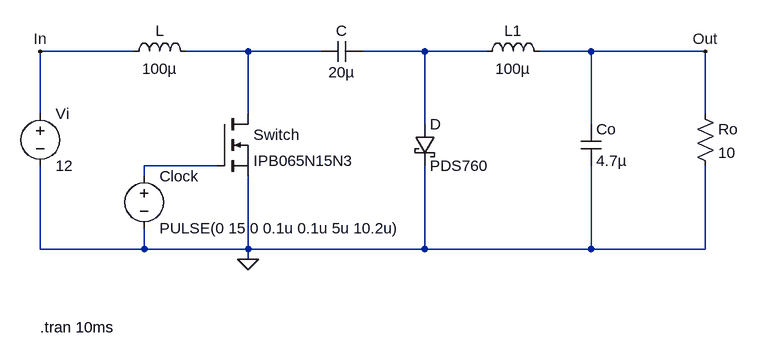
[diagram p0: schematic Cuk Converter.asc]
Cuk Converter.asc, the LTspice schematic file:
Version 4.1
SHEET 1 880 680
WIRE -240 -64 -384 -64
WIRE -64 -64 -160 -64
WIRE 48 -64 -64 -64
WIRE 208 -64 112 -64
WIRE 304 -64 208 -64
WIRE 464 -64 384 -64
WIRE 640 -64 464 -64
WIRE -384 32 -384 -64
WIRE -64 32 -64 -64
WIRE 640 32 640 -64
WIRE 208 48 208 -64
WIRE 464 48 464 -64
WIRE -112 112 -224 112
WIRE -224 128 -224 112
WIRE -384 240 -384 112
WIRE -224 240 -224 208
WIRE -224 240 -384 240
WIRE -64 240 -64 128
WIRE -64 240 -224 240
WIRE 208 240 208 112
WIRE 208 240 -64 240
WIRE 464 240 464 112
WIRE 464 240 208 240
WIRE 640 240 640 112
WIRE 640 240 464 240
WIRE -64 256 -64 240
FLAG -64 256 0
FLAG 640 -64 Out
FLAG -384 -64 In
SYMBOL nmos -112 32 R0
SYMATTR InstName Switch
SYMATTR Value IPB065N15N3
SYMBOL ind -256 -48 R270
WINDOW 0 32 56 VTop 2
WINDOW 3 5 56 VBottom 2
SYMATTR InstName L
SYMATTR Value 100µ
SYMBOL schottky 192 48 R0
SYMATTR InstName D
SYMATTR Value PDS760
SYMATTR Description Diode
SYMATTR Type diode
SYMBOL cap 448 48 R0
SYMATTR InstName Co
SYMATTR Value 4.7µ
SYMBOL res 624 16 R0
SYMATTR InstName Ro
SYMATTR Value 10
SYMBOL voltage -224 112 R0
WINDOW 123 0 0 Left 2
WINDOW 39 0 0 Left 2
SYMATTR InstName Clock
SYMATTR Value PULSE(0 15 0 0.1u 0.1u 5u 10.2u)
SYMBOL voltage -384 16 R0
WINDOW 123 0 0 Left 2
WINDOW 39 0 0 Left 2
SYMATTR InstName Vi
SYMATTR Value 12
SYMBOL cap 112 -48 M270
WINDOW 0 32 32 VTop 2
WINDOW 3 0 32 VBottom 2
SYMATTR InstName C
SYMATTR Value 20µ
SYMBOL ind 288 -48 R270
WINDOW 0 32 56 VTop 2
WINDOW 3 5 56 VBottom 2
SYMATTR InstName L1
SYMATTR Value 100µ
TEXT -384 360 Left 2 !.tran 10ms

The netlist it stands for:
* Cuk Converter.asc
M§Switch N001 N003 0 0 IPB065N15N3
L In N001 100µ
D N002 0 PDS760
Co Out 0 4.7µ
Ro Out 0 10
V§Clock N003 0 PULSE(0 15 0 0.1u 0.1u 5u 10.2u)
Vi In 0 12
C N002 N001 20µ
L1 N002 Out 100µ
.model D D
.lib standard.dio
.model NMOS NMOS
.model PMOS PMOS
.lib standard.mos
.tran 10ms
.backanno
.end